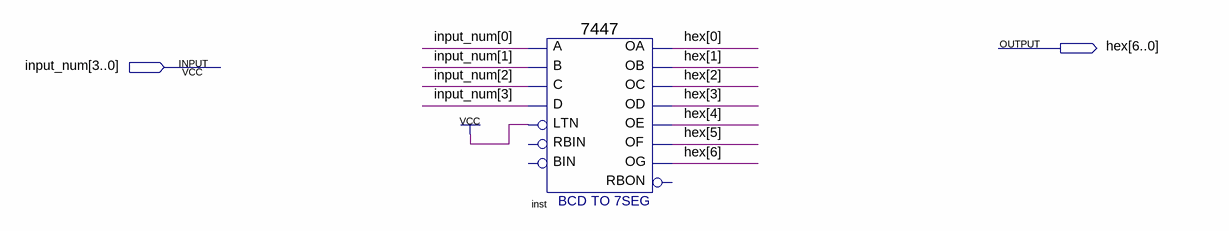
[diagram p0: schematic sheet]
// Quartus schematic bcd_2_hex.bdf as structural Verilog: 1 symbols, 2 pins
module bcd_2_hex (
  input  [3:0] input_num,
  output [6:0] hex
);

  \7447  inst (
    .LTN(1'b1), .B(input_num[1]), .C(input_num[2]), .D(input_num[3]), .A(input_num[0]), .OB(hex[1]),
    .OC(hex[2]), .OE(hex[4]), .OD(hex[3]), .OF(hex[5]), .OG(hex[6]), .OA(hex[0]));  // open: RBIN, BIN, RBON
endmodule
